# Altium project IEEE_Robot_Mainboard.PrjPcb (part 1 of 2)
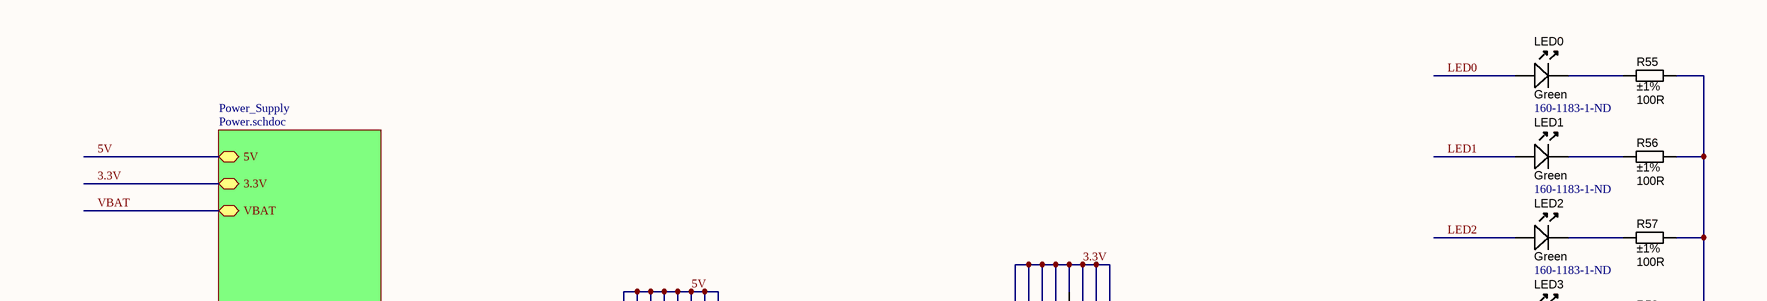
[diagram p0: Main.SchDoc, top right]
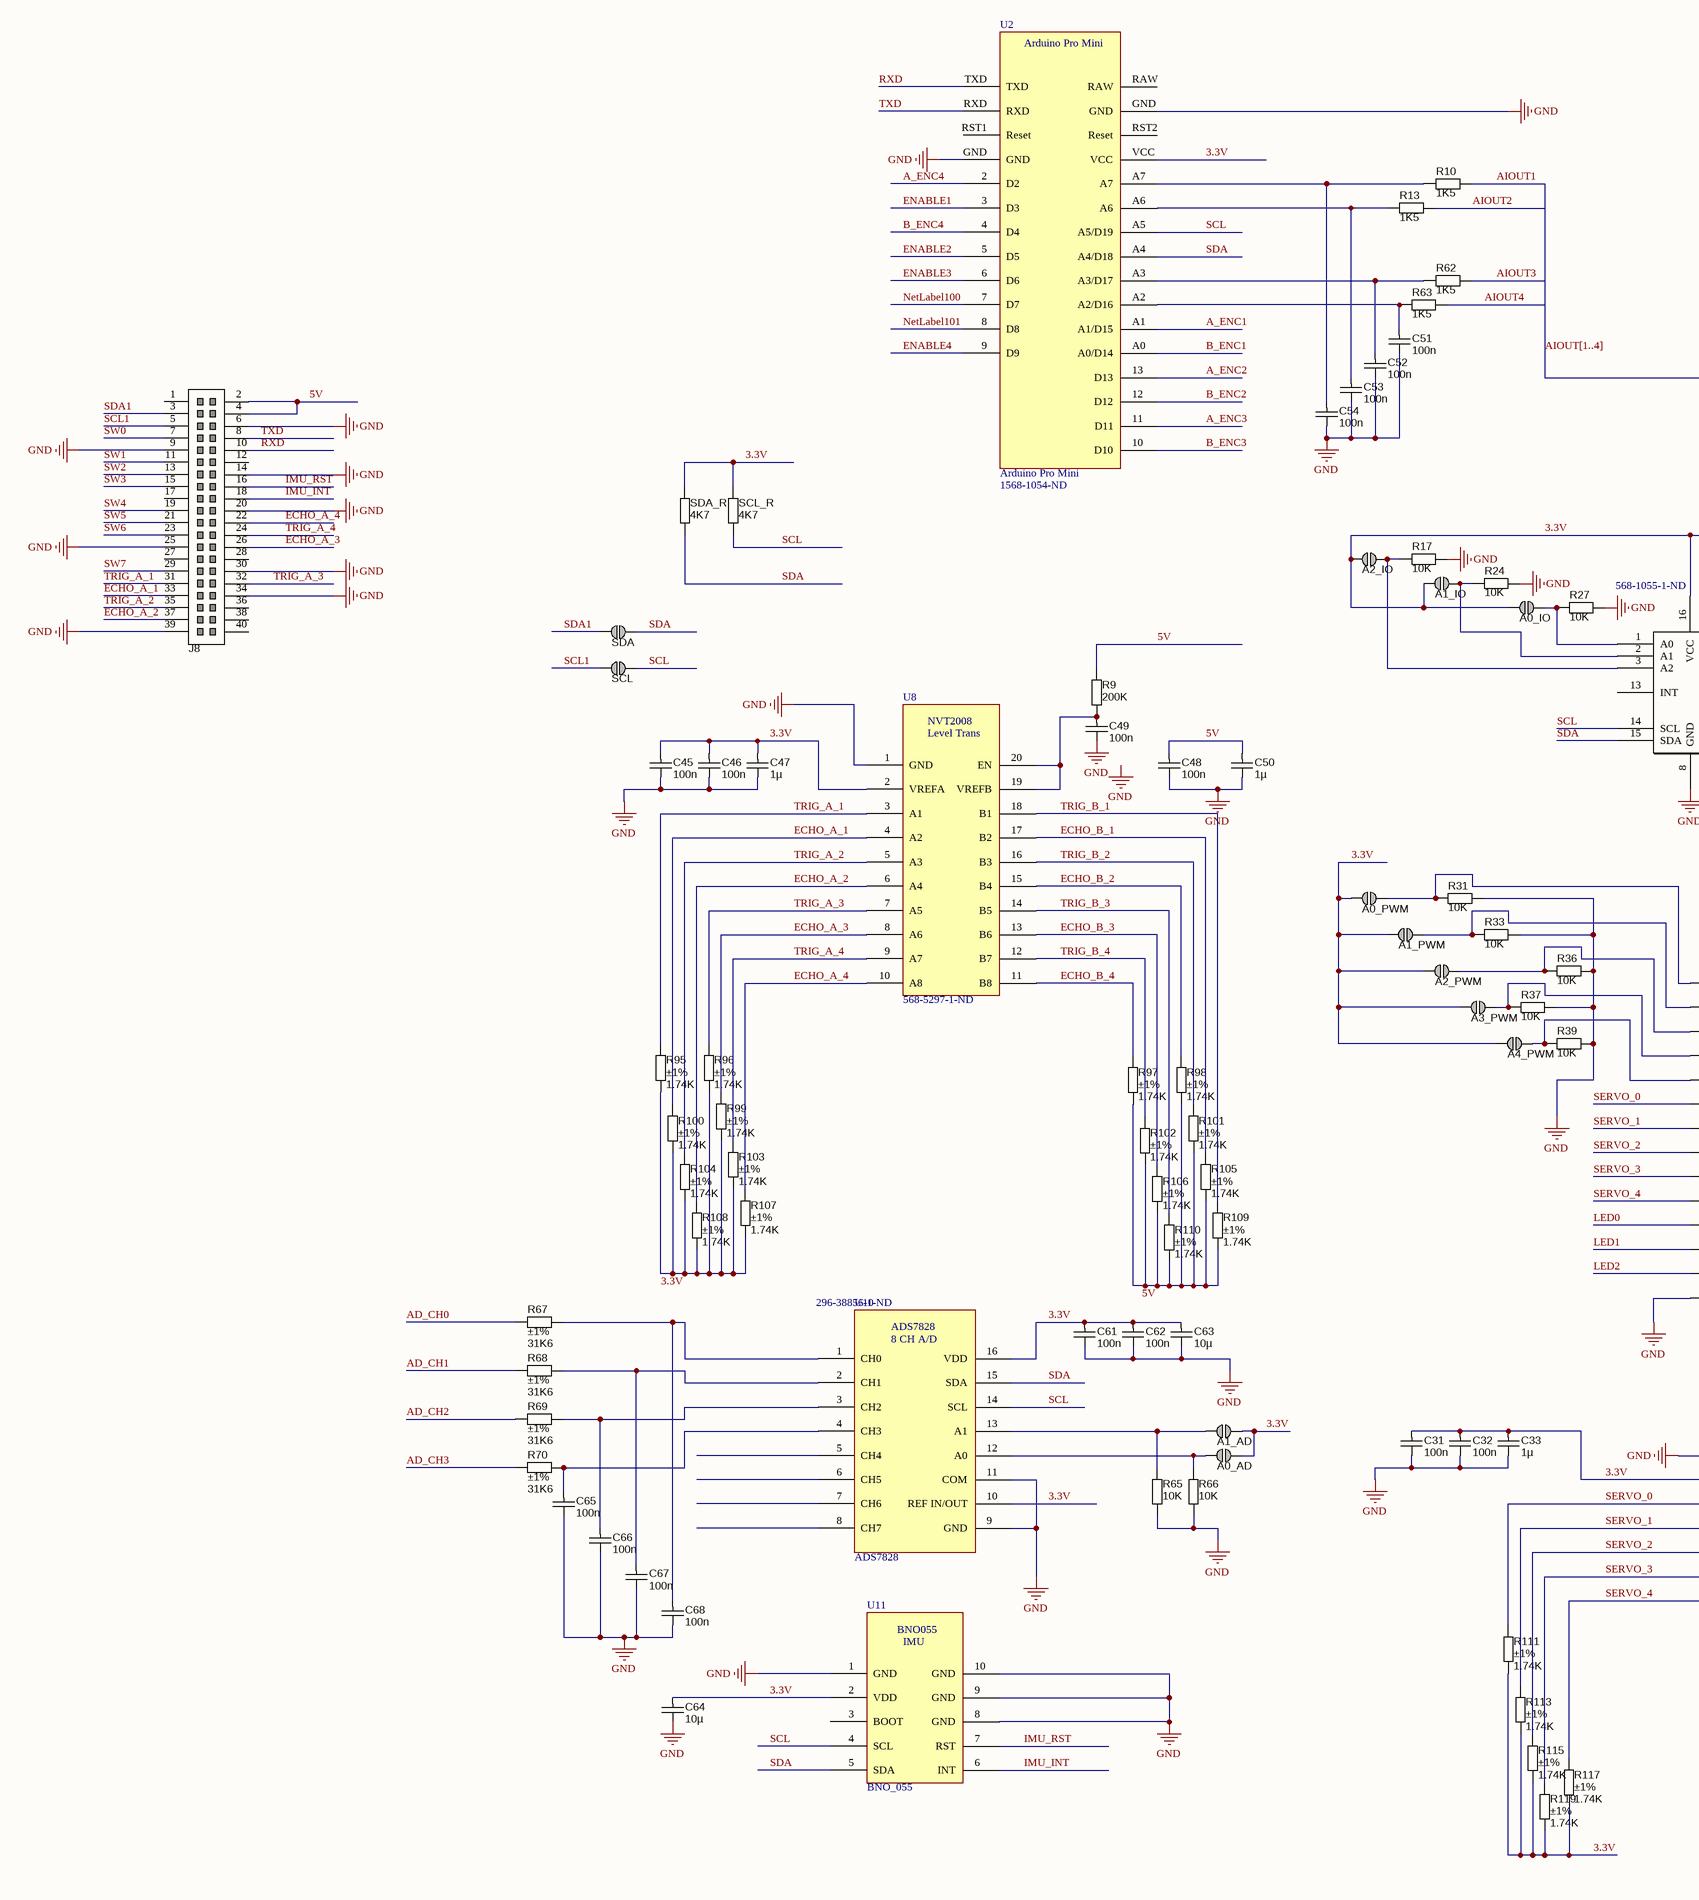
[diagram p1: Main.SchDoc, bottom left]
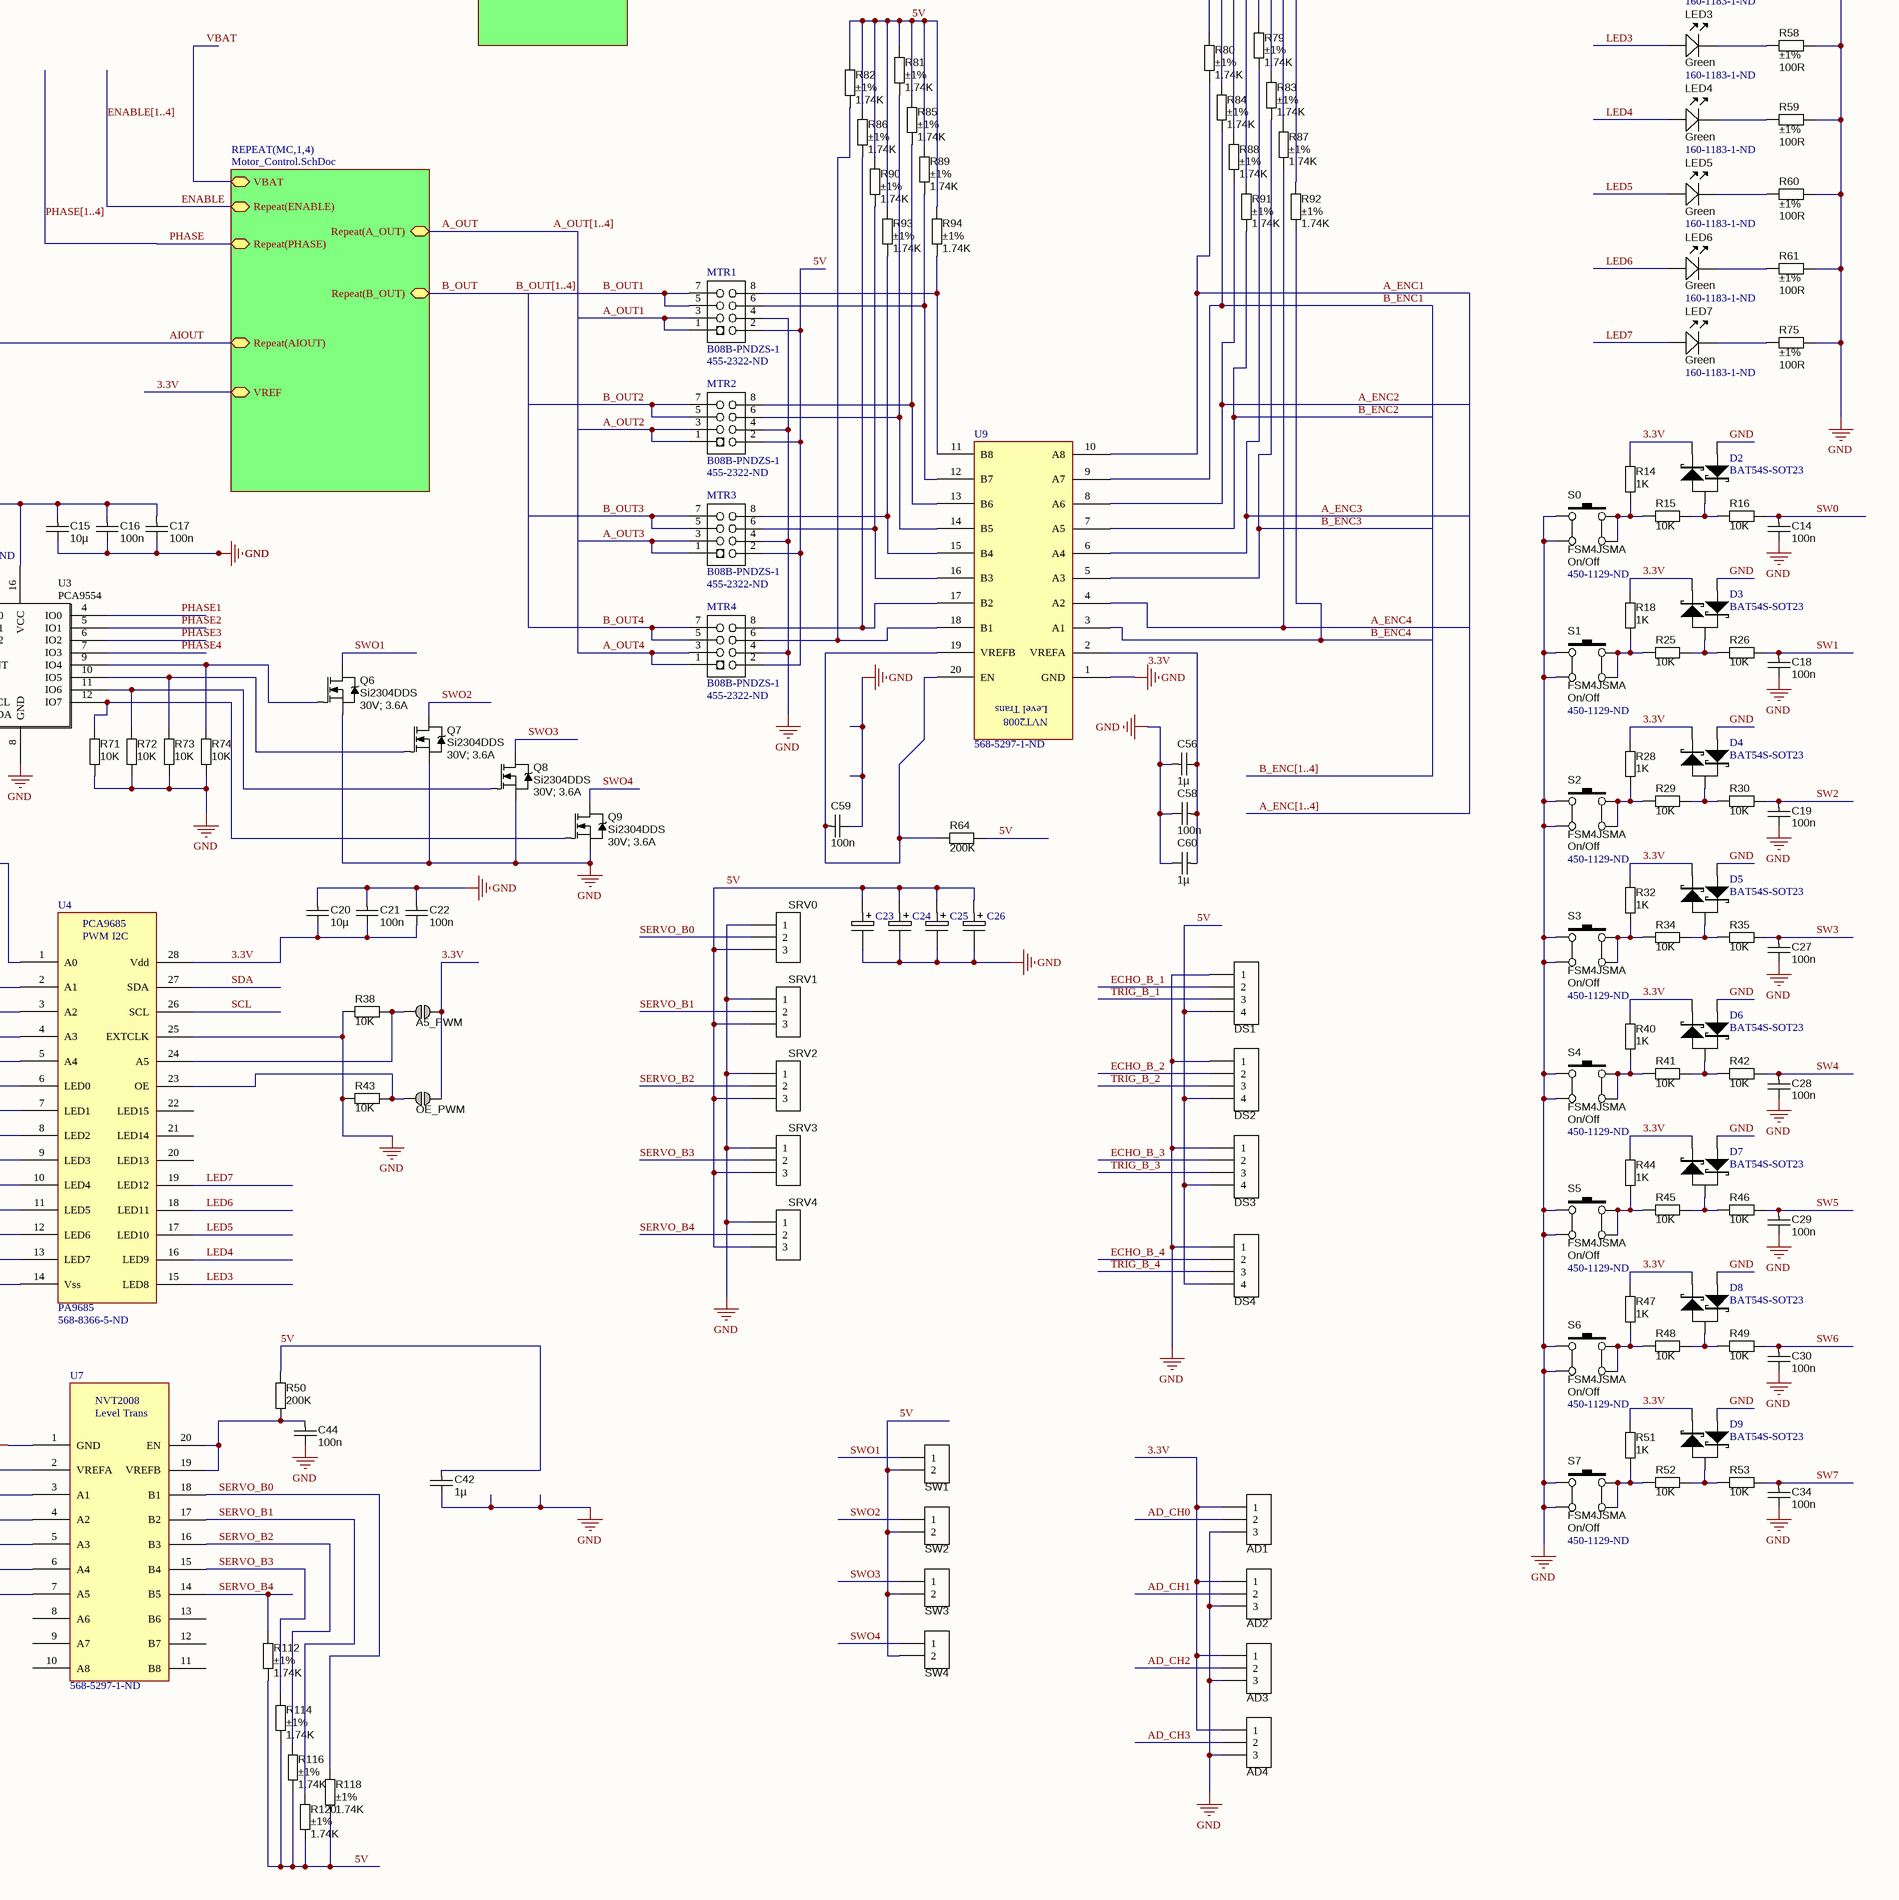
[diagram p2: Main.SchDoc, bottom right]
3 sheets, 361 parts. Net scope: hierarchical (ports join the sheet entries above them; power ports are global).
Board file: Motor_Control_Board.PcbDoc
Sheets:
  Main.SchDoc
    MC1 = Motor_Control.SchDoc
    MC2 = Motor_Control.SchDoc
    MC3 = Motor_Control.SchDoc
    MC4 = Motor_Control.SchDoc
    Power_Supply = Power.schdoc

## Sheet Main.SchDoc
size D

### Parts
A0_AD  Jumper  [JUMP1]  (value not drawn)  (no BOM)
A0_IO  Jumper  [JUMP1]  (value not drawn)  (no BOM)
A0_PWM  Jumper  [JUMP1]  (value not drawn)  (no BOM)
A1_AD  Jumper  [JUMP1]  (value not drawn)  (no BOM)
A1_IO  Jumper  [JUMP1]  (value not drawn)  (no BOM)
A1_PWM  Jumper  [JUMP1]  (value not drawn)  (no BOM)
A2_IO  Jumper  [JUMP1]  (value not drawn)  (no BOM)
A2_PWM  Jumper  [JUMP1]  (value not drawn)  (no BOM)
A3_PWM  Jumper  [JUMP1]  (value not drawn)  (no BOM)
A4_PWM  Jumper  [JUMP1]  (value not drawn)  (no BOM)
A5_PWM  Jumper  [JUMP1]  (value not drawn)  (no BOM)
AD1  JST_PH_B3B  [JST_PH_3_B3B]  (value not drawn)
AD2  JST_PH_B3B  [JST_PH_3_B3B]  (value not drawn)
AD3  JST_PH_B3B  [JST_PH_3_B3B]  (value not drawn)
AD4  JST_PH_B3B  [JST_PH_3_B3B]  (value not drawn)
C14  value 100n  [CAPC1608X90N]  (hidden comment: approved sub OK)
C15  value 10µ  [CAPC2012X135N]  (hidden comment: approved sub OK)
C16  value 100n  [CAPC1608X90N]  (hidden comment: approved sub OK)
C17  value 100n  [CAPC1608X90N]  (hidden comment: approved sub OK)
C18  value 100n  [CAPC1608X90N]  (hidden comment: approved sub OK)
C19  value 100n  [CAPC1608X90N]  (hidden comment: approved sub OK)
C20  value 10µ  [CAPC2012X135N]  (hidden comment: approved sub OK)
C21  value 100n  [CAPC1608X90N]  (hidden comment: approved sub OK)
C22  value 100n  [CAPC1608X90N]  (hidden comment: approved sub OK)
C23  UUD1C221MCL1GS  [NICH 6.3mm 7.7mm]  (value not drawn)
C24  UUD1C221MCL1GS  [NICH 6.3mm 7.7mm]  (value not drawn)
C25  UUD1C221MCL1GS  [NICH 6.3mm 7.7mm]  (value not drawn)
C26  UUD1C221MCL1GS  [NICH 6.3mm 7.7mm]  (value not drawn)
C27  value 100n  [CAPC1608X90N]  (hidden comment: approved sub OK)
C28  value 100n  [CAPC1608X90N]  (hidden comment: approved sub OK)
C29  value 100n  [CAPC1608X90N]  (hidden comment: approved sub OK)
C30  value 100n  [CAPC1608X90N]  (hidden comment: approved sub OK)
C31  value 100n  [CAPC1608X90N]  (hidden comment: approved sub OK)
C32  value 100n  [CAPC1608X90N]  (hidden comment: approved sub OK)
C33  value 1µ  [CAPC1608X90N]  (hidden comment: approved sub OK)
C34  value 100n  [CAPC1608X90N]  (hidden comment: approved sub OK)
C42  value 1µ  [CAPC1608X90N]  (hidden comment: approved sub OK)
C44  value 100n  [CAPC1608X90N]  (hidden comment: approved sub OK)
C45  value 100n  [CAPC1608X90N]  (hidden comment: approved sub OK)
C46  value 100n  [CAPC1608X90N]  (hidden comment: approved sub OK)
C47  value 1µ  [CAPC1608X90N]  (hidden comment: approved sub OK)
C48  value 100n  [CAPC1608X90N]  (hidden comment: approved sub OK)
C49  value 100n  [CAPC1608X90N]  (hidden comment: approved sub OK)
C50  value 1µ  [CAPC1608X90N]  (hidden comment: approved sub OK)
C51  value 100n  [CAPC1608X90N]  (hidden comment: approved sub OK)
C52  value 100n  [CAPC1608X90N]  (hidden comment: approved sub OK)
C53  value 100n  [CAPC1608X90N]  (hidden comment: approved sub OK)
C54  value 100n  [CAPC1608X90N]  (hidden comment: approved sub OK)
C56  value 1µ  [CAPC1608X90N]  (hidden comment: approved sub OK)
C58  value 100n  [CAPC1608X90N]  (hidden comment: approved sub OK)
C59  value 100n  [CAPC1608X90N]  (hidden comment: approved sub OK)
C60  value 1µ  [CAPC1608X90N]  (hidden comment: approved sub OK)
C61  value 100n  [CAPC1608X90N]  (hidden comment: approved sub OK)
C62  value 100n  [CAPC1608X90N]  (hidden comment: approved sub OK)
C63  value 10µ  [CAPC2012X135N]  (hidden comment: approved sub OK)
C64  value 10µ  [CAPC2012X135N]  (hidden comment: approved sub OK)
C65  value 100n  [CAPC1608X90N]  (hidden comment: approved sub OK)
C66  value 100n  [CAPC1608X90N]  (hidden comment: approved sub OK)
C67  value 100n  [CAPC1608X90N]  (hidden comment: approved sub OK)
C68  value 100n  [CAPC1608X90N]  (hidden comment: approved sub OK)
D2  BAT54S-SOT23  [SOT23-123]
D3  BAT54S-SOT23  [SOT23-123]
D4  BAT54S-SOT23  [SOT23-123]
D5  BAT54S-SOT23  [SOT23-123]
D6  BAT54S-SOT23  [SOT23-123]
D7  BAT54S-SOT23  [SOT23-123]
D8  BAT54S-SOT23  [SOT23-123]
D9  BAT54S-SOT23  [SOT23-123]
DS1  JST_PH_B4B  [JST_PH_4_B4B]  (value not drawn)
DS2  JST_PH_B4B  [JST_PH_4_B4B]  (value not drawn)
DS3  JST_PH_B4B  [JST_PH_4_B4B]  (value not drawn)
DS4  JST_PH_B4B  [JST_PH_4_B4B]  (value not drawn)
J8  2223  [40P_PCB_SOCKET_BRD_MNT  REVERSE]  (value not drawn)
LED0  Green  Supplier Part Number 1: 160-1183-1-ND  [LED-0603-GREEN]
LED1  Green  Supplier Part Number 1: 160-1183-1-ND  [LED-0603-GREEN]
LED2  Green  Supplier Part Number 1: 160-1183-1-ND  [LED-0603-GREEN]
LED3  Green  Supplier Part Number 1: 160-1183-1-ND  [LED-0603-GREEN]
LED4  Green  Supplier Part Number 1: 160-1183-1-ND  [LED-0603-GREEN]
LED5  Green  Supplier Part Number 1: 160-1183-1-ND  [LED-0603-GREEN]
LED6  Green  Supplier Part Number 1: 160-1183-1-ND  [LED-0603-GREEN]
LED7  Green  Supplier Part Number 1: 160-1183-1-ND  [LED-0603-GREEN]
MTR1  B08B-PNDZS-1  Supplier Part Number 1: 455-2322-ND  [JST PND 8 Pin]
MTR2  B08B-PNDZS-1  Supplier Part Number 1: 455-2322-ND  [JST PND 8 Pin]
MTR3  B08B-PNDZS-1  Supplier Part Number 1: 455-2322-ND  [JST PND 8 Pin]
MTR4  B08B-PNDZS-1  Supplier Part Number 1: 455-2322-ND  [JST PND 8 Pin]
OE_PWM  Jumper  [JUMP1]  (value not drawn)  (no BOM)
Q6  Si2304DDS  Ratings: 30V; 3.6A  [SOT23-3]
Q7  Si2304DDS  Ratings: 30V; 3.6A  [SOT23-3]
Q8  Si2304DDS  Ratings: 30V; 3.6A  [SOT23-3]
Q9  Si2304DDS  Ratings: 30V; 3.6A  [SOT23-3]
R9  value 200K  [RESC1608X55N]  (hidden comment: Thick Film)
R10  value 1K5  [RESC1608X55N]  (hidden comment: Thick Film)
R13  value 1K5  [RESC1608X55N]  (hidden comment: Thick Film)
R14  value 1K  [RESC1608X55N]  (hidden comment: Thick Film)
R15  value 10K  [RESC1608X55N]  (hidden comment: Thick Film)
R16  value 10K  [RESC1608X55N]  (hidden comment: Thick Film)
R17  value 10K  [RESC1608X55N]  (hidden comment: Thick Film)
R18  value 1K  [RESC1608X55N]  (hidden comment: Thick Film)
R24  value 10K  [RESC1608X55N]  (hidden comment: Thick Film)
R25  value 10K  [RESC1608X55N]  (hidden comment: Thick Film)
R26  value 10K  [RESC1608X55N]  (hidden comment: Thick Film)
R27  value 10K  [RESC1608X55N]  (hidden comment: Thick Film)
R28  value 1K  [RESC1608X55N]  (hidden comment: Thick Film)
R29  value 10K  [RESC1608X55N]  (hidden comment: Thick Film)
R30  value 10K  [RESC1608X55N]  (hidden comment: Thick Film)
R31  value 10K  [RESC1608X55N]  (hidden comment: Thick Film)
R32  value 1K  [RESC1608X55N]  (hidden comment: Thick Film)
R33  value 10K  [RESC1608X55N]  (hidden comment: Thick Film)
R34  value 10K  [RESC1608X55N]  (hidden comment: Thick Film)
R35  value 10K  [RESC1608X55N]  (hidden comment: Thick Film)
R36  value 10K  [RESC1608X55N]  (hidden comment: Thick Film)
R37  value 10K  [RESC1608X55N]  (hidden comment: Thick Film)
R38  value 10K  [RESC1608X55N]  (hidden comment: Thick Film)
R39  value 10K  [RESC1608X55N]  (hidden comment: Thick Film)
R40  value 1K  [RESC1608X55N]  (hidden comment: Thick Film)
R41  value 10K  [RESC1608X55N]  (hidden comment: Thick Film)
R42  value 10K  [RESC1608X55N]  (hidden comment: Thick Film)
R43  value 10K  [RESC1608X55N]  (hidden comment: Thick Film)
R44  value 1K  [RESC1608X55N]  (hidden comment: Thick Film)
R45  value 10K  [RESC1608X55N]  (hidden comment: Thick Film)
R46  value 10K  [RESC1608X55N]  (hidden comment: Thick Film)
R47  value 1K  [RESC1608X55N]  (hidden comment: Thick Film)
R48  value 10K  [RESC1608X55N]  (hidden comment: Thick Film)
R49  value 10K  [RESC1608X55N]  (hidden comment: Thick Film)
R50  value 200K  [RESC1608X55N]  (hidden comment: Thick Film)
R51  value 1K  [RESC1608X55N]  (hidden comment: Thick Film)
R52  value 10K  [RESC1608X55N]  (hidden comment: Thick Film)
R53  value 10K  [RESC1608X55N]  (hidden comment: Thick Film)
R55  value 100R  Tolerance: ±1%  [RESC1608X55N]  (hidden comment: Thick Film)
R56  value 100R  Tolerance: ±1%  [RESC1608X55N]  (hidden comment: Thick Film)
R57  value 100R  Tolerance: ±1%  [RESC1608X55N]  (hidden comment: Thick Film)
R58  value 100R  Tolerance: ±1%  [RESC1608X55N]  (hidden comment: Thick Film)
R59  value 100R  Tolerance: ±1%  [RESC1608X55N]  (hidden comment: Thick Film)
R60  value 100R  Tolerance: ±1%  [RESC1608X55N]  (hidden comment: Thick Film)
R61  value 100R  Tolerance: ±1%  [RESC1608X55N]  (hidden comment: Thick Film)
R62  value 1K5  [RESC1608X55N]  (hidden comment: Thick Film)
R63  value 1K5  [RESC1608X55N]  (hidden comment: Thick Film)
R64  value 200K  [RESC1608X55N]  (hidden comment: Thick Film)
R65  value 10K  [RESC1608X55N]  (hidden comment: Thick Film)
R66  value 10K  [RESC1608X55N]  (hidden comment: Thick Film)
R67  value 31K6  Tolerance: ±1%  [RESC1608X55N]  (hidden comment: Thick Film)
R68  value 31K6  Tolerance: ±1%  [RESC1608X55N]  (hidden comment: Thick Film)
R69  value 31K6  Tolerance: ±1%  [RESC1608X55N]  (hidden comment: Thick Film)
R70  value 31K6  Tolerance: ±1%  [RESC1608X55N]  (hidden comment: Thick Film)
R71  value 10K  [RESC1608X55N]  (hidden comment: Thick Film)
R72  value 10K  [RESC1608X55N]  (hidden comment: Thick Film)
R73  value 10K  [RESC1608X55N]  (hidden comment: Thick Film)
R74  value 10K  [RESC1608X55N]  (hidden comment: Thick Film)
R75  value 100R  Tolerance: ±1%  [RESC1608X55N]  (hidden comment: Thick Film)
R79  value 1.74K  Tolerance: ±1%  [RESC1608X55N]  (hidden comment: Thick Film)
R80  value 1.74K  Tolerance: ±1%  [RESC1608X55N]  (hidden comment: Thick Film)
R81  value 1.74K  Tolerance: ±1%  [RESC1608X55N]  (hidden comment: Thick Film)
R82  value 1.74K  Tolerance: ±1%  [RESC1608X55N]  (hidden comment: Thick Film)
R83  value 1.74K  Tolerance: ±1%  [RESC1608X55N]  (hidden comment: Thick Film)
R84  value 1.74K  Tolerance: ±1%  [RESC1608X55N]  (hidden comment: Thick Film)
R85  value 1.74K  Tolerance: ±1%  [RESC1608X55N]  (hidden comment: Thick Film)
R86  value 1.74K  Tolerance: ±1%  [RESC1608X55N]  (hidden comment: Thick Film)
R87  value 1.74K  Tolerance: ±1%  [RESC1608X55N]  (hidden comment: Thick Film)
R88  value 1.74K  Tolerance: ±1%  [RESC1608X55N]  (hidden comment: Thick Film)
R89  value 1.74K  Tolerance: ±1%  [RESC1608X55N]  (hidden comment: Thick Film)
R90  value 1.74K  Tolerance: ±1%  [RESC1608X55N]  (hidden comment: Thick Film)
R91  value 1.74K  Tolerance: ±1%  [RESC1608X55N]  (hidden comment: Thick Film)
R92  value 1.74K  Tolerance: ±1%  [RESC1608X55N]  (hidden comment: Thick Film)
R93  value 1.74K  Tolerance: ±1%  [RESC1608X55N]  (hidden comment: Thick Film)
R94  value 1.74K  Tolerance: ±1%  [RESC1608X55N]  (hidden comment: Thick Film)
R95  value 1.74K  Tolerance: ±1%  [RESC1608X55N]  (hidden comment: Thick Film)
R96  value 1.74K  Tolerance: ±1%  [RESC1608X55N]  (hidden comment: Thick Film)
R97  value 1.74K  Tolerance: ±1%  [RESC1608X55N]  (hidden comment: Thick Film)
R98  value 1.74K  Tolerance: ±1%  [RESC1608X55N]  (hidden comment: Thick Film)
R99  value 1.74K  Tolerance: ±1%  [RESC1608X55N]  (hidden comment: Thick Film)
R100  value 1.74K  Tolerance: ±1%  [RESC1608X55N]  (hidden comment: Thick Film)
R101  value 1.74K  Tolerance: ±1%  [RESC1608X55N]  (hidden comment: Thick Film)
R102  value 1.74K  Tolerance: ±1%  [RESC1608X55N]  (hidden comment: Thick Film)
R103  value 1.74K  Tolerance: ±1%  [RESC1608X55N]  (hidden comment: Thick Film)
R104  value 1.74K  Tolerance: ±1%  [RESC1608X55N]  (hidden comment: Thick Film)
R105  value 1.74K  Tolerance: ±1%  [RESC1608X55N]  (hidden comment: Thick Film)
R106  value 1.74K  Tolerance: ±1%  [RESC1608X55N]  (hidden comment: Thick Film)
R107  value 1.74K  Tolerance: ±1%  [RESC1608X55N]  (hidden comment: Thick Film)
R108  value 1.74K  Tolerance: ±1%  [RESC1608X55N]  (hidden comment: Thick Film)
R109  value 1.74K  Tolerance: ±1%  [RESC1608X55N]  (hidden comment: Thick Film)
R110  value 1.74K  Tolerance: ±1%  [RESC1608X55N]  (hidden comment: Thick Film)
R111  value 1.74K  Tolerance: ±1%  [RESC1608X55N]  (hidden comment: Thick Film)
R112  value 1.74K  Tolerance: ±1%  [RESC1608X55N]  (hidden comment: Thick Film)
R113  value 1.74K  Tolerance: ±1%  [RESC1608X55N]  (hidden comment: Thick Film)
R114  value 1.74K  Tolerance: ±1%  [RESC1608X55N]  (hidden comment: Thick Film)
R115  value 1.74K  Tolerance: ±1%  [RESC1608X55N]  (hidden comment: Thick Film)
R116  value 1.74K  Tolerance: ±1%  [RESC1608X55N]  (hidden comment: Thick Film)
R117  value 1.74K  Tolerance: ±1%  [RESC1608X55N]  (hidden comment: Thick Film)
R118  value 1.74K  Tolerance: ±1%  [RESC1608X55N]  (hidden comment: Thick Film)
R119  value 1.74K  Tolerance: ±1%  [RESC1608X55N]  (hidden comment: Thick Film)
R120  value 1.74K  Tolerance: ±1%  [RESC1608X55N]  (hidden comment: Thick Film)
S0  FSM4JSMA  Function: On/Off  Supplier Part Number 1: 450-1129-ND  [TACT_6mmx6mm]
S1  FSM4JSMA  Function: On/Off  Supplier Part Number 1: 450-1129-ND  [TACT_6mmx6mm]
S2  FSM4JSMA  Function: On/Off  Supplier Part Number 1: 450-1129-ND  [TACT_6mmx6mm]
S3  FSM4JSMA  Function: On/Off  Supplier Part Number 1: 450-1129-ND  [TACT_6mmx6mm]
S4  FSM4JSMA  Function: On/Off  Supplier Part Number 1: 450-1129-ND  [TACT_6mmx6mm]
S5  FSM4JSMA  Function: On/Off  Supplier Part Number 1: 450-1129-ND  [TACT_6mmx6mm]
S6  FSM4JSMA  Function: On/Off  Supplier Part Number 1: 450-1129-ND  [TACT_6mmx6mm]
S7  FSM4JSMA  Function: On/Off  Supplier Part Number 1: 450-1129-ND  [TACT_6mmx6mm]
SCL  Jumper  [JUMP1]  (value not drawn)  (no BOM)
SCL_R  value 4K7  [RESC1608X55N]  (hidden comment: Thick Film)
SDA  Jumper  [JUMP1]  (value not drawn)  (no BOM)
SDA_R  value 4K7  [RESC1608X55N]  (hidden comment: Thick Film)
SRV0  JST_PH_B3B  [JST_PH_3_B3B]  (value not drawn)
SRV1  JST_PH_B3B  [JST_PH_3_B3B]  (value not drawn)
SRV2  JST_PH_B3B  [JST_PH_3_B3B]  (value not drawn)
SRV3  JST_PH_B3B  [JST_PH_3_B3B]  (value not drawn)
SRV4  JST_PH_B3B  [JST_PH_3_B3B]  (value not drawn)
SW1  JST_PH_B2B  [JST_PH_2_B2B]  (value not drawn)
SW2  JST_PH_B2B  [JST_PH_2_B2B]  (value not drawn)
SW3  JST_PH_B2B  [JST_PH_2_B2B]  (value not drawn)
SW4  JST_PH_B2B  [JST_PH_2_B2B]  (value not drawn)
U2  Arduino Pro Mini  Supplier Part Number 1: 1568-1054-ND  [Arduino Pro Mini]
U3  PCA9554  Supplier Part Number 1: 568-1055-1-ND  [TSSOP65P640X120-16N]
U4  PA9685  Supplier Part Number 1: 568-8366-5-ND  [TSSOP28]
U7  Supplier Part Number 1: 568-5297-1-ND  [TSSOP65P640X120-20N]  (hidden comment: NVT2008)
U8  Supplier Part Number 1: 568-5297-1-ND  [TSSOP65P640X120-20N]  (hidden comment: NVT2008)
U9  Supplier Part Number 1: 568-5297-1-ND  [TSSOP65P640X120-20N]  (hidden comment: NVT2008)
U10  ADS7828  Supplier Part Number 1: 296-38856-1-ND  [TSSOP65P640X120-16N]
U11  BNO_055  [BNO-055]

### Sub-sheets
Power_Supply = Power.schdoc: 5V, 3.3V, VBAT
REPEAT(MC,1,4) = Motor_Control.SchDoc: VBAT, Repeat(ENABLE), Repeat(PHASE), Repeat(AIOUT), VREF, Repeat(A_OUT), Repeat(B_OUT)

### Nets
GND: AD1.3 AD2.3 AD3.3 AD4.3 C14.2 C15.2 C16.2 C17.2 C18.2 C19.2 C20.1 C21.1 C22.1 C23.- C24.- C25.- C26.- C27.2 C28.2 C29.2 C30.2 C31.2 C32.2 C33.2 C34.2 C42.2 C44.2 C45.2 C46.2 C47.2 C48.2 C49.2 C50.2 C51.2 C52.2 C53.2 C54.2 C56.1 C58.2 C59.2 C60.2 C61.2 C62.2 C63.2 C64.2 C65.2 C66.2 C67.2 C68.2 D2.1 D3.1 D4.1 D5.1 D6.1 D7.1 D8.1 D9.1 DS1.1 DS2.1 DS3.1 DS4.1 J8.6(D_GND) J8.9(P0.4) J8.14(D_GND) J8.20(D_GND) J8.25(PFI_4/P1.4) J8.30(D_GND) J8.34(D_GND) J8.39(PFI_11/P2.3) MTR1.4 MTR2.4 MTR3.4 MTR4.4 Q6.2(S) Q7.2(S) Q8.2(S) Q9.2(S) R17.2 R24.2 R27.2 R31.2 R33.2 R36.2 R37.2 R38.2 R39.2 R43.2 R55.2 R56.2 R57.2 R58.2 R59.2 R60.2 R61.2 R65.2 R66.2 R71.2 R72.2 R73.2 R74.2 R75.2 S0.1 S0.2 S1.1 S1.2 S2.1 S2.2 S3.1 S3.2 S4.1 S4.2 S5.1 S5.2 S6.1 S6.2 S7.1 S7.2 SRV0.1 SRV1.1 SRV2.1 SRV3.1 SRV4.1 U2.GND U3.8(GND) U4.14(Vss) U4.25(EXTCLK) U7.1(GND) U8.1(GND) U9.1(GND) U10.9(GND) U10.11(COM) U11.1(GND) U11.8(GND) U11.9(GND) U11.10(GND)
3.3V: A0_AD.1 A0_IO.2 A0_PWM.2 A1_AD.1 A1_IO.2 A1_PWM.2 A2_IO.2 A2_PWM.2 A3_PWM.2 A4_PWM.2 A5_PWM.2 AD1.1 AD2.1 AD3.1 AD4.1 C15.1 C16.1 C17.1 C20.2 C21.2 C22.2 C31.1 C32.1 C33.1 C45.1 C46.1 C47.1 C56.2 C58.1 C60.1 C61.1 C62.1 C63.1 C64.1 D2.2 D3.2 D4.2 D5.2 D6.2 D7.2 D8.2 D9.2 OE_PWM.2 R14.1 R18.1 R28.1 R32.1 R40.1 R44.1 R47.1 R51.1 R79.1 R80.1 R83.1 R84.1 R87.1 R88.1 R91.1 R92.1 R95.1 R96.1 R99.1 R100.1 R103.1 R104.1 R107.1 R108.1 R111.1 R113.1 R115.1 R117.1 R119.1 SCL_R.1 SDA_R.1 U2.VCC U3.16(VCC) U4.28(Vdd) U7.2(VREFA) U8.2(VREFA) U9.2(VREFA) U10.10(REF_IN/OUT) U10.16(VDD) U11.2(VDD) ; sheet REPEAT(MC,1,4)/VREF, sheet Power_Supply/3.3V
5V: C23.+ C24.+ C25.+ C26.+ C42.1 C48.1 C50.1 DS1.4 DS2.4 DS3.4 DS4.4 J8.2(D_GND) J8.4(D_GND) MTR1.2 MTR2.2 MTR3.2 MTR4.2 R9.2 R50.2 R64.2 R81.1 R82.1 R85.1 R86.1 R89.1 R90.1 R93.1 R94.1 R97.1 R98.1 R101.1 R102.1 R105.1 R106.1 R109.1 R110.1 R112.1 R114.1 R116.1 R118.1 R120.1 SRV0.3 SRV1.3 SRV2.3 SRV3.3 SRV4.3 SW1.2 SW2.2 SW3.2 SW4.2 ; sheet Power_Supply/5V
A_ENC1: R80.2 U2.A1(A1/D15) U9.10(A8)
A_ENC2: R88.2 U2.13(D13) U9.8(A6)
A_ENC3: R79.2 U2.11(D11) U9.6(A4)
A_ENC4: R87.2 U2.2(D2) U9.4(A2)
A_OUT: sheet REPEAT(MC,1,4)/Repeat(A_OUT)
A_OUT1: MTR1.1 MTR1.3
A_OUT2: MTR2.1 MTR2.3
A_OUT3: MTR3.1 MTR3.3
A_OUT4: MTR4.1 MTR4.3
AD_CH0: AD1.2 R67.1
AD_CH1: AD2.2 R68.1
AD_CH2: AD3.2 R69.1
AD_CH3: AD4.2 R70.1
AIOUT: sheet REPEAT(MC,1,4)/Repeat(AIOUT)
AIOUT1: R10.2
AIOUT2: R13.2
AIOUT3: R62.2
AIOUT4: R63.2
B_ENC1: R84.2 U2.A0(A0/D14) U9.9(A7)
B_ENC2: R91.2 U2.12(D12) U9.7(A5)
B_ENC3: R83.2 U2.10(D10) U9.5(A3)
B_ENC4: R92.2 U2.4(D4) U9.3(A1)
B_OUT: sheet REPEAT(MC,1,4)/Repeat(B_OUT)
B_OUT1: MTR1.5 MTR1.7
B_OUT2: MTR2.5 MTR2.7
B_OUT3: MTR3.5 MTR3.7
B_OUT4: MTR4.5 MTR4.7
ECHO_A_1: J8.33(PFI_8/P2.0) R100.2 U8.4(A2)
ECHO_A_2: J8.37(PFI_10/P2.2) R108.2 U8.6(A4)
ECHO_A_3: J8.26(D_GND) R99.2 U8.8(A6)
ECHO_A_4: J8.22(D_GND) R107.2 U8.10(A8)
ECHO_B_1: DS1.2 R105.2 U8.17(B2)
ECHO_B_2: DS2.2 R98.2 U8.15(B4)
ECHO_B_3: DS3.2 R106.2 U8.13(B6)
ECHO_B_4: DS4.2 R97.2 U8.11(B8)
ENABLE: sheet REPEAT(MC,1,4)/Repeat(ENABLE)
ENABLE1: U2.3(D3)
ENABLE2: U2.5(D5)
ENABLE3: U2.6(D6)
ENABLE4: U2.9(D9)
IMU_INT: J8.18(D_GND) U11.6(INT)
IMU_RST: J8.16(D_GND) U11.7(RST)
LED0: LED0.A U4.11(LED5)
LED1: LED1.A U4.12(LED6)
LED2: LED2.A U4.13(LED7)
LED3: LED3.A U4.15(LED8)
LED4: LED4.A U4.16(LED9)
LED5: LED5.A U4.17(LED10)
LED6: LED6.A U4.18(LED11)
LED7: LED7.A U4.19(LED12)
NetLabel100: U2.7(D7)
NetLabel101: U2.8(D8)
PHASE: sheet REPEAT(MC,1,4)/Repeat(PHASE)
PHASE1: U3.4(IO0)
PHASE2: U3.5(IO1)
PHASE3: U3.6(IO2)
PHASE4: U3.7(IO3)
RXD: J8.10(D_GND) U2.TXD
SCL: SCL.1 SCL_R.2 U2.A5(A5/D19) U3.14(SCL) U4.26(SCL) U10.14(SCL) U11.4(SCL)
SCL1: J8.5(P0.2) SCL.2
SDA: SDA.1 SDA_R.2 U2.A4(A4/D18) U3.15(SDA) U4.27(SDA) U10.15(SDA) U11.5(SDA)
SDA1: J8.3(P0.1) SDA.2
SERVO_0: R111.2 U4.6(LED0) U7.3(A1)
SERVO_1: R113.2 U4.7(LED1) U7.4(A2)
SERVO_2: R115.2 U4.8(LED2) U7.5(A3)
SERVO_3: R119.2 U4.9(LED3) U7.6(A4)
SERVO_4: R117.2 U4.10(LED4) U7.7(A5)
SERVO_B0: R118.2 SRV0.2 U7.18(B1)
SERVO_B1: R120.2 SRV1.2 U7.17(B2)
SERVO_B2: R116.2 SRV2.2 U7.16(B3)
SERVO_B3: R114.2 SRV3.2 U7.15(B4)
SERVO_B4: R112.2 SRV4.2 U7.14(B5)
SW0: C14.1 J8.7(P0.3) R16.2
SW1: C18.1 J8.11(P0.5) R26.2
SW2: C19.1 J8.13(P0.6) R30.2
SW3: C27.1 J8.15(P0.7) R35.2
SW4: C28.1 J8.19(PFI_1/P1.1) R42.2
SW5: C29.1 J8.21(PFI_2/P1.2) R46.2
SW6: C30.1 J8.23(PFI_3/P1.3) R49.2
SW7: C34.1 J8.29(PFI_6/P1.6) R53.2
SWO1: Q6.3(D) SW1.1
SWO2: Q7.3(D) SW2.1
SWO3: Q8.3(D) SW3.1
SWO4: Q9.3(D) SW4.1
TRIG_A_1: J8.31(PFI_7/P1.7) R95.2 U8.3(A1)
TRIG_A_2: J8.35(PFI_9/P2.1) R104.2 U8.5(A3)
TRIG_A_3: J8.32(D_GND) R96.2 U8.7(A5)
TRIG_A_4: J8.24(D_GND) R103.2 U8.9(A7)
TRIG_B_1: DS1.3 R109.2 U8.18(B1)
TRIG_B_2: DS2.3 R101.2 U8.16(B3)
TRIG_B_3: DS3.3 R110.2 U8.14(B5)
TRIG_B_4: DS4.3 R102.2 U8.12(B7)
TXD: J8.8(D_GND) U2.RXD
VBAT: sheet REPEAT(MC,1,4)/VBAT, sheet Power_Supply/VBAT
NetA0_AD_2: A0_AD.2 R66.1 U10.12(A0)
NetA0_IO_1: A0_IO.1 R27.1 U3.1(A0)
NetA0_PWM_1: A0_PWM.1 R31.1 U4.1(A0)
NetA1_AD_2: A1_AD.2 R65.1 U10.13(A1)
NetA1_IO_1: A1_IO.1 R24.1 U3.2(A1)
NetA1_PWM_1: A1_PWM.1 R33.1 U4.2(A1)
NetA2_IO_1: A2_IO.1 R17.1 U3.3(A2)
NetA2_PWM_1: A2_PWM.1 R36.1 U4.3(A2)
NetA3_PWM_1: A3_PWM.1 R37.1 U4.4(A3)
NetA4_PWM_1: A4_PWM.1 R39.1 U4.5(A4)
NetA5_PWM_1: A5_PWM.1 R38.1 U4.24(A5)
NetC44_1: C44.1 R50.1 U7.19(VREFB) U7.20(EN)
NetC49_1: C49.1 R9.1 U8.19(VREFB) U8.20(EN)
NetC51_1: C51.1 R63.1 U2.A2(A2/D16)
NetC52_1: C52.1 R62.1 U2.A3(A3/D17)
NetC53_1: C53.1 R13.1 U2.A6
NetC54_1: C54.1 R10.1 U2.A7
NetC59_1: C59.1 R64.1 U9.19(VREFB) U9.20(EN)
NetC65_1: C65.1 R70.2 U10.4(CH3)
NetC66_1: C66.1 R69.2 U10.3(CH2)
NetC67_1: C67.1 R68.2 U10.2(CH1)
NetC68_1: C68.1 R67.2 U10.1(CH0)
NetD2_3: D2.3 R15.2 R16.1
NetD3_3: D3.3 R25.2 R26.1
NetD4_3: D4.3 R29.2 R30.1
NetD5_3: D5.3 R34.2 R35.1
NetD6_3: D6.3 R41.2 R42.1
NetD7_3: D7.3 R45.2 R46.1
NetD8_3: D8.3 R48.2 R49.1
NetD9_3: D9.3 R52.2 R53.1
NetLED0_K: LED0.K R55.1
NetLED1_K: LED1.K R56.1
NetLED2_K: LED2.K R57.1
NetLED3_K: LED3.K R58.1
NetLED4_K: LED4.K R59.1
NetLED5_K: LED5.K R60.1
NetLED6_K: LED6.K R61.1
NetLED7_K: LED7.K R75.1
NetMTR1_6: MTR1.6 R89.2 U9.12(B7)
NetMTR1_8: MTR1.8 R94.2 U9.11(B8)
NetMTR2_6: MTR2.6 R81.2 U9.14(B5)
NetMTR2_8: MTR2.8 R85.2 U9.13(B6)
NetMTR3_6: MTR3.6 R90.2 U9.16(B3)
NetMTR3_8: MTR3.8 R93.2 U9.15(B4)
NetMTR4_6: MTR4.6 R82.2 U9.18(B1)
NetMTR4_8: MTR4.8 R86.2 U9.17(B2)
NetOE_PWM_1: OE_PWM.1 R43.1 U4.23(OE)
NetQ6_1: Q6.1(G) R74.1 U3.9(IO4)
NetQ7_1: Q7.1(G) R73.1 U3.10(IO5)
NetQ8_1: Q8.1(G) R72.1 U3.11(IO6)
NetQ9_1: Q9.1(G) R71.1 U3.12(IO7)
NetR14_2: R14.2 R15.1 S0.3 S0.4
NetR18_2: R18.2 R25.1 S1.3 S1.4
NetR28_2: R28.2 R29.1 S2.3 S2.4
NetR32_2: R32.2 R34.1 S3.3 S3.4
NetR40_2: R40.2 R41.1 S4.3 S4.4
NetR44_2: R44.2 R45.1 S5.3 S5.4
NetR47_2: R47.2 R48.1 S6.3 S6.4
NetR51_2: R51.2 R52.1 S7.3 S7.4

Not connected (* = marked no-connect by the designer): J8 1(P0.0) 12(D_GND) 17(PFI_0/P1.0) 27(PFI_5/P1.5) 28(D_GND) 36(D_GND) 38(D_GND) 40(D_GND); U2 RAW RST1(Reset) RST2(Reset); U3 13(INT); U4 20(LED13) 21(LED14) 22(LED15); U7 8(A6) 9(A7) 10(A8) 11(B8) 12(B7) 13(B6); U10 5(CH4) 6(CH5) 7(CH6) 8(CH7); U11 3(BOOT)

### Buses and harness runs
bus A_ENC[1..4]
bus A_OUT[1..4]
bus AIOUT[1..4]
bus B_ENC[1..4]
bus B_OUT[1..4]
bus ENABLE[1..4]
bus PHASE[1..4]

### Notes on the sheet
- Labels drawn without touching a wire or pin: GND
- (in symbol ADS7828) 8 CH A/D
- (in symbol BNO_055) BNO055; IMU
- (in symbol IC_VLEVEL_TRANSLATOR_NVT2008) Level Trans
- (in symbol PCA9685) PWM I2C

### Library data of the parts
A0_AD A0_IO A0_PWM A1_AD A1_IO A1_PWM A2_IO A2_PWM A3_PWM A4_PWM A5_PWM OE_PWM SCL SDA = JUMP1: SMD jumper
AD1-AD4 SRV0-SRV4 = JST_PH_B3B: 2mm Pitch; Supplier 1: Digi-Key; Supplier Part Number 1: 455-1705-ND
C14 C16-C19 C21 C22 C27-C32 C34 C44-C46 C48 C49 C51-C54 C58 C59 C61 C62 C65-C68 = CAPC_100n_0603_X7R_50V_10%: Capacitor SMD Cer 100nF 10% 50V X7R 0603; Ratings: 50V; X7R; Material: ceramic; SCDType: spec; Package / Case: 0603 (1608 Metric); Tolerance: ±10%; ComponentLink1URL: http://www.avx.com/docs/Catalogs/cx7r.pdf; ComponentLink1Description: http://www.avx.com/docs/Catalogs/cx7r.pdf; ComponentLink2URL: http://product.tdk.com/capacitor/mlcc/en/documents/mlcc_commercial_general_en.pdf; ComponentLink2Description: http://product.tdk.com/capacitor/mlcc/en/documents/mlcc_commercial_general_en.pdf; Supplier 1: Digi-Key; Supplier Part Number 1: 709-1161-1-ND
C15 C20 C63 C64 = CAPC_10u_0805_10V: Capacitor SMD Cer 10uF 10% 10V X5R 0805; Ratings: 10V; X5R; Material: ceramic; SCDType: spec; Package / Case: 0805 (2012 metric); Tolerance: ±10%; ComponentLink1URL: http://www.avx.com/docs/Catalogs/cx5r.pdf; ComponentLink1Description: http://www.avx.com/docs/Catalogs/cx5r.pdf; ComponentLink2URL: http://www.kemet.com/datasheets&C0805C106K8PACTU; ComponentLink2Description: http://www.kemet.com/datasheets&C0805C106K8PACTU; Supplier 1: Digi-Key; Supplier Part Number 1: 709-1228-1-ND
C23-C26 = NICHICON_220uF_16V: GENERIC CAPACITOR POLARISED; Supplier 1: Digi-Key; Supplier Part Number 1: 493-2264-1-ND
C33 C42 C47 C50 C56 C60 = CAPC_1u_0603_X7R_16V_10%: Capacitor SMD Cer 1uF 10% 16V X7R 0603; Manufacturer 1: TDK Corporation; Manufacturer Part Number 1: C1608X7R1C105K; Ratings: 16V; X7R; Material: ceramic; SCDType: spec; Package / Case: 0603 (1608 metric); Tolerance: ±10%; Supplier 1: Digi-Key; Supplier Part Number 1: 445-1604-1-ND; ComponentLink1URL: http://product.tdk.com/capacitor/mlcc/en/documents/mlcc_commercial_general_en.pdf; ComponentLink1Description: http://product.tdk.com/capacitor/mlcc/en/documents/mlcc_commercial_general_en.pdf
D2-D9 = BAT54S-SOT23: DUAL SCHOTTKY DIODE SERIES; Manufacturer Part Number: BAT54S,215; Manufacturer: NXP Semiconductors; Voltage - DC Reverse (Vr) (Max): 30V; Speed: Small Signal =< 200mA (Io), Any Speed; Current - Reverse Leakage @ Vr: 2µA @ 25V; Diode Configuration: 1 Pair Series Connection; Voltage - Forward (Vf) (Max) @ If: 800mV @ 100mA; Current - Average Rectified (Io) (per Diode): 200mA (DC); Reverse Recovery Time (trr): 5ns; Supplier 1: Digi-Key; Supplier Part Number 1: 568-1614-1-ND; Diode Type: Schottky; Package / Case: SOT-23-3, TO-236-3, Micro3™, SSD3, SST3; Packaging: Cut Tape (CT); Mounting Type: Surface Mount; Supplier Part Number: 568-1614-1-ND; RoHS: RoHS Compliant; Supplier: Digi-Key; Category: Discrete Semiconductor Products
DS1-DS4 = JST_PH_B4B: 2mm Pitch; Supplier 1: Digi-Key; Supplier Part Number 1: 455-1706-ND
J8 = CONN_SOCKET_2x20P_0.100in  Rpi Female: 40 Position Header Connector 0.100" (2.54mm) Through Hole Gold; Value: Double-row, 50 positions; SCDType: undef; Category: Connectors; Mounting Type: Through Hole; Pitch: 0.100" (2.54mm); Terminal Block Type: Socket, Female; Package / Case: Connector socket; 2.54mm pitch; Supplier 1: Digi-Key; Supplier Part Number 1: 1528-1385-ND
LED0-LED7 = LED_SMD_Green_0603_525nm_350mcd: LED 0603 SMD Green 525nm 350mcd 20mA; Material: InGaN; Ratings: 200mcd min; 350 mcd typ @ 20mA; Voltage - Forward (Vf) @ 10mA: 3.1V; Viewing Angle: 120°; Lens Style/Size: Rectangle with Flat Top, 1.2mm x 0.8mm; Voltage - Forward (Vf) @ 20mA: 3.3V; SCDType: source; Package / Case: 0603 (1608 metric); Color: Green; Current - Test: 20mA; ComponentLink1URL: http://www.mouser.com/ds/2/216/APT1608ZGCK-262051.pdf; ComponentLink1Description: http://www.mouser.com/ds/2/216/APT1608ZGCK-262051.pdf; ComponentLink2Description: APT1608-WAP24 Datasheet; ComponentLink2URL: \\SVFI2\PBLShare\Eng\Electrical Engineering\Hardware\Altium\Libraries and Templates\Unreleased Components\Part Number Request 2013-10-02\APT1608-WAP24(Ver.1B).pdf; Supplier 1: Digi-Key
MTR1-MTR4 = JST PND 8 PIN: Supplier 1: Digi-Key
Q6-Q9 = MOSFET_Si2304DDS: MOSFET SMD N-CH 30V 3.6A 1.7W SOT23-3; Material: Metal Oxide; SCDType: source; Package / Case: SOT23-3; Supplier 1: Digi-Key; Supplier Part Number 1: SI2304DDS-T1-GE3CT-ND
R9 R50 R64 = RES_200K_0603_5%: Resistor SMD chip 200K Ohm 0.1W 5% 0603; Ratings: 1/10 W; SCDType: undef; Package / Case: 0603 (1608 metric); Tolerance: ±5%; Material: Thick Film; Supplier 1: Digi-Key; Supplier Part Number 1: RMCF0603JT200KDKR-ND
R10 R13 R62 R63 = RES_1K5_0603_5%: Resistor SMD chip 1.5k Ohm 0.1W 5% 0603; Manufacturer 1: Yageo; Manufacturer Part Number 1: RC0603JR-071K5L; Ratings: 1/10 W; SCDType: spec; Package / Case: 0603 (1608 metric); Tolerance: ±5%; Material: thick film; Supplier 1: Digi-Key; Supplier Part Number 1: 311-1.5KGRCT-ND
R14 R18 R28 R32 R40 R44 R47 R51 = RES_1K_0603_5%: Resistor SMD chip 1k Ohm 0.1W 5% 0603; Manufacturer 1: Yageo; Manufacturer Part Number 1: RC0603JR-071KL; Ratings: 1/10 W; SCDType: spec; Package / Case: 0603 (1608 metric); Tolerance: ±5%; Material: Thick Film; Supplier 1: Digi-Key; Supplier Part Number 1: 311-1.0KGRCT-ND; Supplier 2: Digi-Key; Supplier Part Number 2: 541-1.0KGCT-ND; Manufacturer 2: Vishay Dale; Manufacturer Part Number 2: CRCW06031K00JNEA; ComponentLink2URL: http://www.vishay.com/doc?20008; ComponentLink2Description: http://www.vishay.com/doc?20008; ComponentLink1URL: http://www.yageo.com/documents/recent/PYu-RC0603_51_RoHS_L_4.pdf; ComponentLink1Description: http://www.yageo.com/documents/recent/PYu-RC0603_51_RoHS_L_4.pdf
R15-R17 R24-R27 R29-R31 R33-R39 R41-R43 R45 R46 R48 R49 R52 R53 R65 R66 R71-R74 = RES_10K_0603_5%: Resistor SMD chip 10k Ohm 0.1W 5% 0603; Manufacturer 1: Yageo; Manufacturer Part Number 1: RC0603JR-0710KL; Ratings: 1/10 W; SCDType: spec; Package / Case: 0603 (1608 metric); Tolerance: ±5%; Material: Thick Film; Supplier 1: Digi-Key; Supplier Part Number 1: 311-10KGRCT-ND; Supplier 2: Digi-Key; Supplier Part Number 2: 541-10KGCT-ND; Manufacturer 2: Vishay Dale; Manufacturer Part Number 2: CRCW060310K0JNEA; ComponentLink2URL: http://www.vishay.com/doc?20035; ComponentLink2Description: http://www.vishay.com/doc?20035; ComponentLink1URL: http://www.yageo.com/documents/recent/PYu-RC0603_51_RoHS_L_4.pdf; ComponentLink1Description: http://www.yageo.com/documents/recent/PYu-RC0603_51_RoHS_L_4.pdf
R55-R61 R75 = RES_100R_0603_1%: Resistor SMD chip 100 Ohm 0.1W 1% 0603; Manufacturer 1: Yageo; Manufacturer Part Number 1: RC0603FR-07100RL; Ratings: 1/10 W; SCDType: spec; Package / Case: 0603 (1608 Metric); Material: Thick Film; Supplier 1: Digi-Key; Supplier Part Number 1: 311-100HRCT-ND; Supplier 2: Digi-Key; Supplier Part Number 2: P100HTR-ND; Manufacturer 2: Panasonic - ECG; Manufacturer Part Number 2: ERJ-3EKF1000V; ComponentLink1URL: http://industrial.panasonic.com/www-cgi/jvcr13pz.cgi?E+PZ+3+AOA0002+ERJ3EKF1000V+7+WW; ComponentLink1Description: http://industrial.panasonic.com/www-cgi/jvcr13pz.cgi?E+PZ+3+AOA0002+ERJ3EKF1000V+7+WW
R67-R70 = RES_31K6_0603_1%: Resistor SMD chip 31.6k Ohm 0.1W 1% 0603; Manufacturer 1: Yageo; Manufacturer Part Number 1: RC0603FR-0731K6L; Ratings: 1/10W; SCDType: spec; Package / Case: 0603 (1608 Metric); Supplier 1: Digi-Key; Supplier Part Number 1: 311-31.6KHRCT-ND
R79-R120 = RES_1K74_0603_1%: Resistor SMD chip 1.74k Ohm 0.1W 1% 0603; Ratings: 1/10W; SCDType: spec; Package / Case: 0603 (1608 Metric); Supplier 1: Digi-Key; Supplier Part Number 1: 311-1.74KHRCT-ND
S0-S7 = TACT_SWITCH 6x6: Manufacturer 1: Bond-Tact; Manufacturer Part Number 1: TS-1143S-WP-200; SCDType: spec; Package / Case: 6.5x6.5mm; 4.3mm stem; Supplier 1: Digi-Key
SCL_R SDA_R = RES_4K7_0603_5%: Resistor SMD chip 4.7k Ohm 0.1W 5% 0603; Manufacturer 1: Vishay/Dale; Manufacturer Part Number 1: CRCW06034K70JNEA; Ratings: 1/10 W; SCDType: spec; Package / Case: 0603 (1608 metric); Tolerance: ±5%; Material: Thick Film; Supplier 1: Digi-Key; Supplier Part Number 1: 541-4.7KGCT-ND
SW1-SW4 = JST_PH_B2B: 2mm Pitch; Supplier 1: Digi-Key; Supplier Part Number 1: 455-1704-ND
U3 = PCA9554: IO EXPANDER PUSH PULL WEAK PULLUP; Supplier 1: Digi-Key
U4 = PCA9685: LED Driver IC 16 Output Linear PWM Dimming 25mA 28-TSSOP; Supplier 1: Digi-Key
U7-U9 = IC_VLEVEL_TRANSLATOR_NVT2008: IC TRANSLATOR BIDIR VOLT 20TSSOP; Supplier 1: Digi-Key
U10 = ADS7828: 12-Bit, 8-Channel Sampling ANALOG-TO-DIGITAL CONVERTER with I2C™ Interface; Supplier 1: Digi-Key
U11 = BNO_055: 9-axis motion sensor with hardware fusion
U2 = Arduino Pro Mini: Supplier 1: Digi-Key

## Sheet Motor_Control.SchDoc
size B
Used 4 times, as channels MC1, MC2, MC3, MC4. Parts and nets are listed once, with the designators drawn on the sheet.
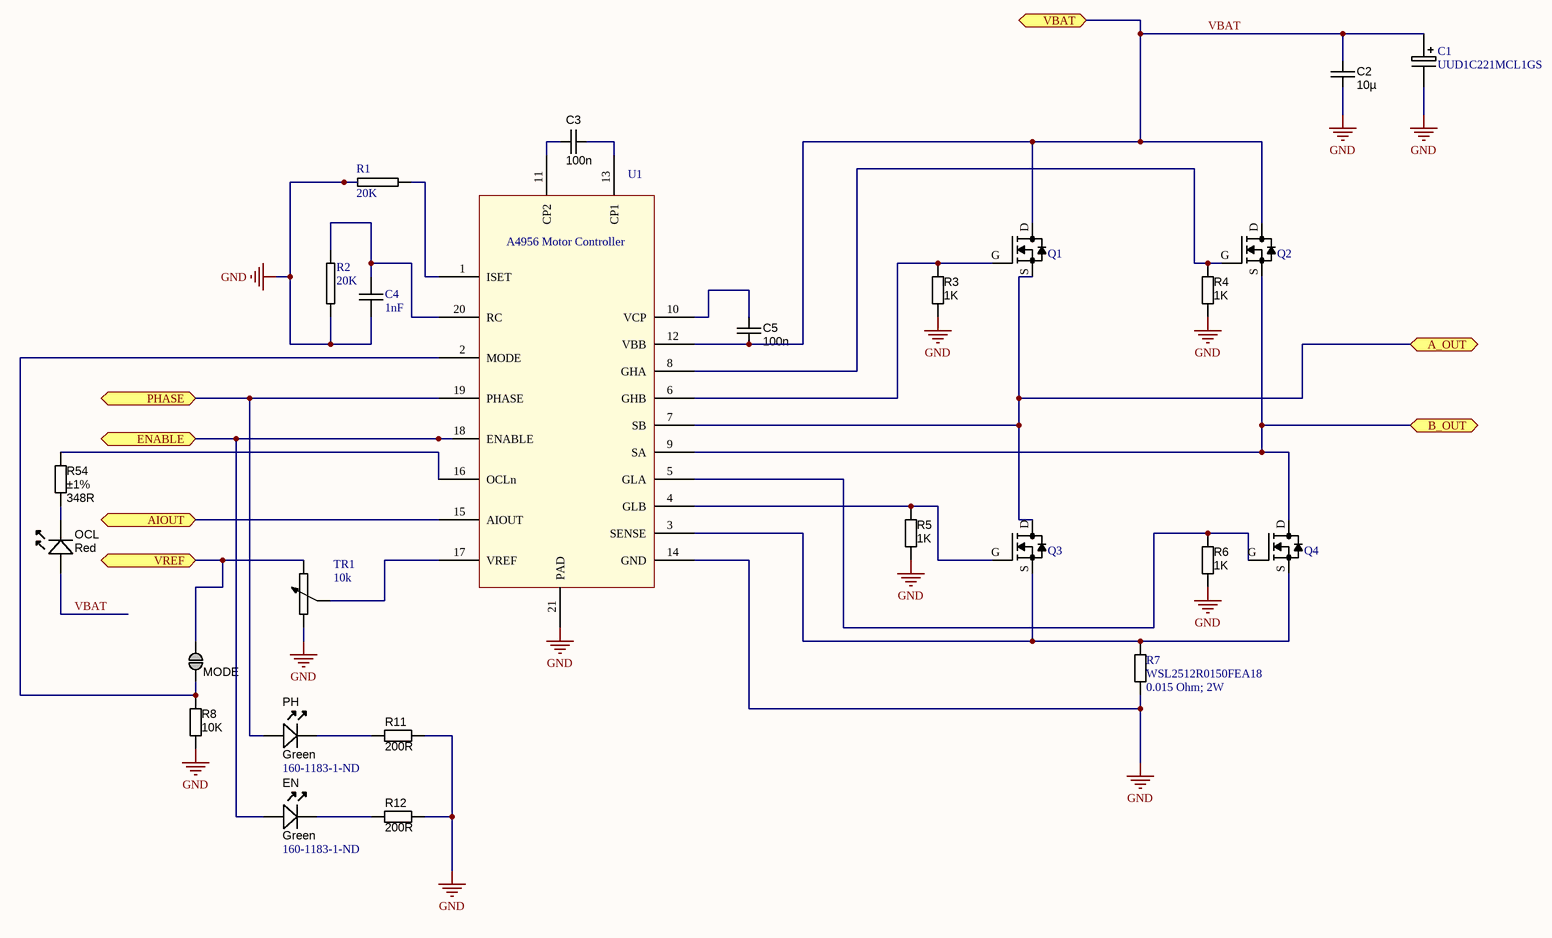
[diagram p3: Motor_Control.SchDoc]

### Parts
C1  UUD1C221MCL1GS  [NICH 6.3mm 7.7mm]
C2  value 10µ  [CAPC2012X135N]  (hidden comment: approved sub OK)
C3  value 100n  [CAPC1608X90N]  (hidden comment: approved sub OK)
C4  1nF  [0603C-GENERIC]
C5  value 100n  [CAPC1608X90N]  (hidden comment: approved sub OK)
EN  Green  Supplier Part Number 1: 160-1183-1-ND  [LED-0603-GREEN]
MODE  Jumper  [JUMP1]  (value not drawn)  (no BOM)
OCL  Red  [LED-0603-RED]
PH  Green  Supplier Part Number 1: 160-1183-1-ND  [LED-0603-GREEN]
Q1  SIS406DN  [1212-8 PowerPAK Single]  (value not drawn)
Q2  SIS406DN  [1212-8 PowerPAK Single]  (value not drawn)
Q3  SIS406DN  [1212-8 PowerPAK Single]  (value not drawn)
Q4  SIS406DN  [1212-8 PowerPAK Single]  (value not drawn)
R1  20K  [0603R-GENERIC]
R2  20K  [0603R-GENERIC]
R3  value 1K  [RESC1608X55N]  (hidden comment: Thick Film)
R4  value 1K  [RESC1608X55N]  (hidden comment: Thick Film)
R5  value 1K  [RESC1608X55N]  (hidden comment: Thick Film)
R6  value 1K  [RESC1608X55N]  (hidden comment: Thick Film)
R7  WSL2512R0150FEA18  Rating: 0.015 Ohm; 2W  [RESC_2512]
R8  value 10K  [RESC1608X55N]  (hidden comment: Thick Film)
R11  value 200R  [RESC1608X55N]  (hidden comment: Thick Film)
R12  value 200R  [RESC1608X55N]  (hidden comment: Thick Film)
R54  value 348R  Tolerance: ±1%  [RESC1608X55N]  (hidden comment: Thin Film)
TR1  10k  [TRIM3224]
U1  A4956  [QFN-20 - 8mil Pad Spacing]  (value not drawn)

### Ports
A_OUT, AIOUT, B_OUT, ENABLE, PHASE, VBAT, VREF

### Nets
GND: C1.- C2.2 C4.2 R1.1 R2.2 R3.2 R4.2 R5.2 R6.2 R7.2 R8.2 R11.2 R12.2 TR1.1 U1.14(GND) U1.21(PAD)
A_OUT: Q1.S Q3.D U1.7(SB) ; port A_OUT
AIOUT: U1.15(AIOUT) ; port AIOUT
B_OUT: Q2.S Q4.D U1.9(SA) ; port B_OUT
ENABLE: EN.A U1.18(ENABLE) ; port ENABLE
PHASE: PH.A U1.19(PHASE) ; port PHASE
VBAT: C1.+ C2.1 C5.2 OCL.A Q1.D Q2.D U1.12(VBB) ; port VBAT
VREF: MODE.2 TR1.2 ; port VREF
NetC3_1: C3.1 U1.11(CP2)
NetC3_2: C3.2 U1.13(CP1)
NetC4_1: C4.1 R2.1 U1.20(RC)
NetC5_1: C5.1 U1.10(VCP)
NetEN_K: EN.K R12.1
NetMODE_1: MODE.1 R8.1 U1.2(MODE)
NetOCL_K: OCL.K R54.2
NetPH_K: PH.K R11.1
NetQ1_G: Q1.G R3.1 U1.6(GHB)
NetQ2_G: Q2.G R4.1 U1.8(GHA)
NetQ3_G: Q3.G R5.1 U1.4(GLB)
NetQ3_S: Q3.S Q4.S R7.1 U1.3(SENSE)
NetQ4_G: Q4.G R6.1 U1.5(GLA)
NetR1_2: R1.2 U1.1(ISET)
NetR54_1: R54.1 U1.16(OCLn)
NetTR1_W: TR1.W U1.17(VREF)

### Channels
MC1: designators C1=C1_MC1 C2=C2MC1 C3=C3MC1 C4=C4_MC1 C5=C5MC1 EN=ENMC1 MODE=MODEMC1 OCL=OCLMC1 PH=PHMC1 Q1=Q1_MC1 Q2=Q2_MC1 Q3=Q3_MC1 Q4=Q4_MC1 R1=R1_MC1 R2=R2_MC1 R3=R3_MC1 R4=R4_MC1 R5=R5_MC1 R6=R6_MC1 R7=R7_MC1 R8=R8MC1 R11=R11MC1 R12=R12MC1 R54=R54MC1 TR1=TR1MC1 U1=U1_MC1; ports A_OUT=A_OUT1 AIOUT=AIOUT1 B_OUT=B_OUT1 ENABLE=ENABLE1 PHASE=PHASE1 VBAT=VBAT VREF=3.3V
MC2: designators C1=C1_MC2 C2=C2MC2 C3=C3MC2 C4=C4_MC2 C5=C5MC2 EN=ENMC2 MODE=MODEMC2 OCL=OCLMC2 PH=PHMC2 Q1=Q1_MC2 Q2=Q2_MC2 Q3=Q3_MC2 Q4=Q4_MC2 R1=R1_MC2 R2=R2_MC2 R3=R3_MC2 R4=R4_MC2 R5=R5_MC2 R6=R6_MC2 R7=R7_MC2 R8=R8MC2 R11=R11MC2 R12=R12MC2 R54=R54MC2 TR1=TR1MC2 U1=U1_MC2; ports A_OUT=A_OUT2 AIOUT=AIOUT2 B_OUT=B_OUT2 ENABLE=ENABLE2 PHASE=PHASE2 VBAT=VBAT VREF=3.3V
MC3: designators C1=C1_MC3 C2=C2MC3 C3=C3MC3 C4=C4_MC3 C5=C5MC3 EN=ENMC3 MODE=MODEMC3 OCL=OCLMC3 PH=PHMC3 Q1=Q1_MC3 Q2=Q2_MC3 Q3=Q3_MC3 Q4=Q4_MC3 R1=R1_MC3 R2=R2_MC3 R3=R3_MC3 R4=R4_MC3 R5=R5_MC3 R6=R6_MC3 R7=R7_MC3 R8=R8MC3 R11=R11MC3 R12=R12MC3 R54=R54MC3 TR1=TR1MC3 U1=U1_MC3; ports A_OUT=A_OUT3 AIOUT=AIOUT3 B_OUT=B_OUT3 ENABLE=ENABLE3 PHASE=PHASE3 VBAT=VBAT VREF=3.3V
MC4: designators C1=C1_MC4 C2=C2MC4 C3=C3MC4 C4=C4_MC4 C5=C5MC4 EN=ENMC4 MODE=MODEMC4 OCL=OCLMC4 PH=PHMC4 Q1=Q1_MC4 Q2=Q2_MC4 Q3=Q3_MC4 Q4=Q4_MC4 R1=R1_MC4 R2=R2_MC4 R3=R3_MC4 R4=R4_MC4 R5=R5_MC4 R6=R6_MC4 R7=R7_MC4 R8=R8MC4 R11=R11MC4 R12=R12MC4 R54=R54MC4 TR1=TR1MC4 U1=U1_MC4; ports A_OUT=A_OUT4 AIOUT=AIOUT4 B_OUT=B_OUT4 ENABLE=ENABLE4 PHASE=PHASE4 VBAT=VBAT VREF=3.3V

### Notes on the sheet
- (in symbol Motor_CTRL_IC_A4956) A4956 Motor Controller

### Library data of the parts
C1 = NICHICON_220uF_16V: GENERIC CAPACITOR POLARISED; Supplier 1: Digi-Key; Supplier Part Number 1: 493-2264-1-ND
C2 = CAPC_10u_0805_16V: Capacitor SMD Cer 10uF 10% 16V X7R 0805; Ratings: 16V; X7R; Material: ceramic; SCDType: undef; Package / Case: 0805 (2012 metric); Tolerance: ±10%; Supplier 1: Digi-Key; Supplier Part Number 1: 709-1229-1-ND
C3 C5 = CAPC_100n_0603_X7R_50V_10%: as C14 on sheet Main; Package / Case: 0603 (1608 Metric); Tolerance: ±10%; ComponentLink1URL: http://www.avx.com/docs/Catalogs/cx7r.pdf; ComponentLink1Description: http://www.avx.com/docs/Catalogs/cx7r.pdf; ComponentLink2URL: http://product.tdk.com/capacitor/mlcc/en/documents/mlcc_commercial_general_en.pdf; ComponentLink2Description: http://product.tdk.com/capacitor/mlcc/en/documents/mlcc_commercial_general_en.pdf; Supplier 1: Digi-Key; Supplier Part Number 1: 709-1161-1-ND
C4 = 0603C-1NF-50V-X7R: CAPACITOR 0603 CERAMIC; Supplier 1: Digi-Key; Supplier Part Number 1: 709-1151-1-ND
EN PH = LED_SMD_Green_0603_525nm_350mcd: LED 0603 SMD Green 525nm 350mcd 20mA; Ratings: 200mcd min; 350 mcd typ @ 20mA; Voltage - Forward (Vf) @ 10mA: 3.1V; Viewing Angle: 120°; Lens Style/Size: Rectangle with Flat Top, 1.2mm x 0.8mm; Voltage - Forward (Vf) @ 20mA: 3.3V; SCDType: source; Package / Case: 0603 (1608 metric); Material: InGaN; Color: Green; Current - Test: 20mA; ComponentLink1URL: http://www.mouser.com/ds/2/216/APT1608ZGCK-262051.pdf; ComponentLink1Description: http://www.mouser.com/ds/2/216/APT1608ZGCK-262051.pdf; ComponentLink2Description: APT1608-WAP24 Datasheet; ComponentLink2URL: \\SVFI2\PBLShare\Eng\Electrical Engineering\Hardware\Altium\Libraries and Templates\Unreleased Components\Part Number Request 2013-10-02\APT1608-WAP24(Ver.1B).pdf; Supplier 1: Digi-Key
MODE = JUMP1: SMD jumper
OCL = LED_SMD_Red_0603_220mcd: LED 0603 SMD Hyper Red 630nm 220mcd 20mA; Manufacturer 1: Kingbright Company LLC; Manufacturer Part Number 1: APT1608SURCK; Ratings: 220 mcd; 630 nm; Voltage - Forward (Vf) Typ: 1.95V; Voltage - Forward (Vf) @ 10mA: 1.9V; SCDType: source; Package / Case: 0603 (1608 metric); Material: AlGaInP on GaAs; Supplier 1: Digi-Key; Supplier Part Number 1: 754-1123-1-ND; ComponentLink1URL: http://www.us.kingbright.com/images/catalog/SPEC/APT1608SURCK.pdf; ComponentLink1Description: http://www.us.kingbright.com/images/catalog/SPEC/APT1608SURCK.pdf
Q1-Q4 = MOSFET_N_CHAN_SIS406DN: Supplier 1: Digi-Key; Supplier Part Number 1: SIS406DN-T1-GE3CT-ND
R1 R2 = 0603R-20K: GENERIC RESISTOR 0603; Manufacturer: Stackpole Electronics Inc; Manufacturer Part Number: RNCF 16 T2 20K .1% R; Category: Resistors; Supplier Part Number: RNCF16T220KBRCT-ND; Supplier: Digi-Key; Supplier 1: Digi-Key; Supplier Part Number 1: 311-20.0KHRCT-ND
R3-R6 = RES_1K_0603_5%: as R14 on sheet Main; Package / Case: 0603 (1608 metric); Tolerance: ±5%; Material: Thick Film; Supplier 1: Digi-Key; Supplier Part Number 1: 311-1.0KGRCT-ND; Supplier 2: Digi-Key; Supplier Part Number 2: 541-1.0KGCT-ND; Manufacturer 2: Vishay Dale; Manufacturer Part Number 2: CRCW06031K00JNEA; ComponentLink2URL: http://www.vishay.com/doc?20008; ComponentLink2Description: http://www.vishay.com/doc?20008; ComponentLink1URL: http://www.yageo.com/documents/recent/PYu-RC0603_51_RoHS_L_4.pdf; ComponentLink1Description: http://www.yageo.com/documents/recent/PYu-RC0603_51_RoHS_L_4.pdf
R7 = RES_0.015: RES SMD 0.015 OHM 1% 2W 2512; Supplier 1: Digi-Key; Supplier Part Number 1: WSLH-.015CT-ND
R8 = RES_10K_0603_5%: as R15 on sheet Main; Package / Case: 0603 (1608 metric); Tolerance: ±5%; Material: Thick Film; Supplier 1: Digi-Key; Supplier Part Number 1: 311-10KGRCT-ND; Supplier 2: Digi-Key; Supplier Part Number 2: 541-10KGCT-ND; Manufacturer 2: Vishay Dale; Manufacturer Part Number 2: CRCW060310K0JNEA; ComponentLink2URL: http://www.vishay.com/doc?20035; ComponentLink2Description: http://www.vishay.com/doc?20035; ComponentLink1URL: http://www.yageo.com/documents/recent/PYu-RC0603_51_RoHS_L_4.pdf; ComponentLink1Description: http://www.yageo.com/documents/recent/PYu-RC0603_51_RoHS_L_4.pdf
R11 R12 = RES_200R_0603_5%: Resistor SMD chip 200 Ohm 0.1W 5% 0603; Manufacturer 1: Yageo; Manufacturer Part Number 1: RC0603JR-07200RL; Ratings: 1/10 W; SCDType: undef; Package / Case: 0603 (1608 metric); Tolerance: ±5%; Material: Thick Film; Supplier 1: Digi-Key; Supplier Part Number 1: 311-200GRCT-ND
R54 = RES_348R_0603_1%: Resistor SMD chip 348 Ohm 0.1W 1% 0603; Manufacturer 1: Yageo; Manufacturer Part Number 1: RC0603FR-07348RL; Ratings: 1/10 W; SCDType: spec; Package / Case: 0603 (1608 metric); Material: Thin Film; Supplier 1: Digi-Key; Supplier Part Number 1: 311-348HRCT-ND
TR1 = R-TRIM-SMD-10k: GENERIC SMD TRIMMER; Manufacturer Part Number: 3224X-1-103E; Manufacturer: Bourns Inc.; Tolerance: ±10%; Power (Watts): 0.25W, 1/4W; Adjustment Type: Top Adjustment; Resistive Material: Cermet; Resistance In Ohms: 10.0K; Temperature Coefficient: ±100ppm/°C; Number of Turns: 11; Supplier 1: Digi-Key; Supplier Part Number 1: 3214X-1-103EDKR-ND; Supplier: Digi-Key; Category: Potentiometers, Variable Resistors; Supplier Part Number: 3224X-1-103ETR-ND; Package / Case: Square - 0.190" L x 0.139" W x 0.200" H (4.80mm x 3.50mm x 5.10mm); Mounting Type: Surface Mount; RoHS: RoHS Compliant; Taper: -; Packaging: Tape & Reel (TR)
U1 = Motor_CTRL_IC_A4956: PWM Motor Controller; Supplier 1: Digi-Key; Supplier Part Number 1: 620-1772-1-ND